# EAGLE design openLRSngTX (EAGLE 6.5.0)
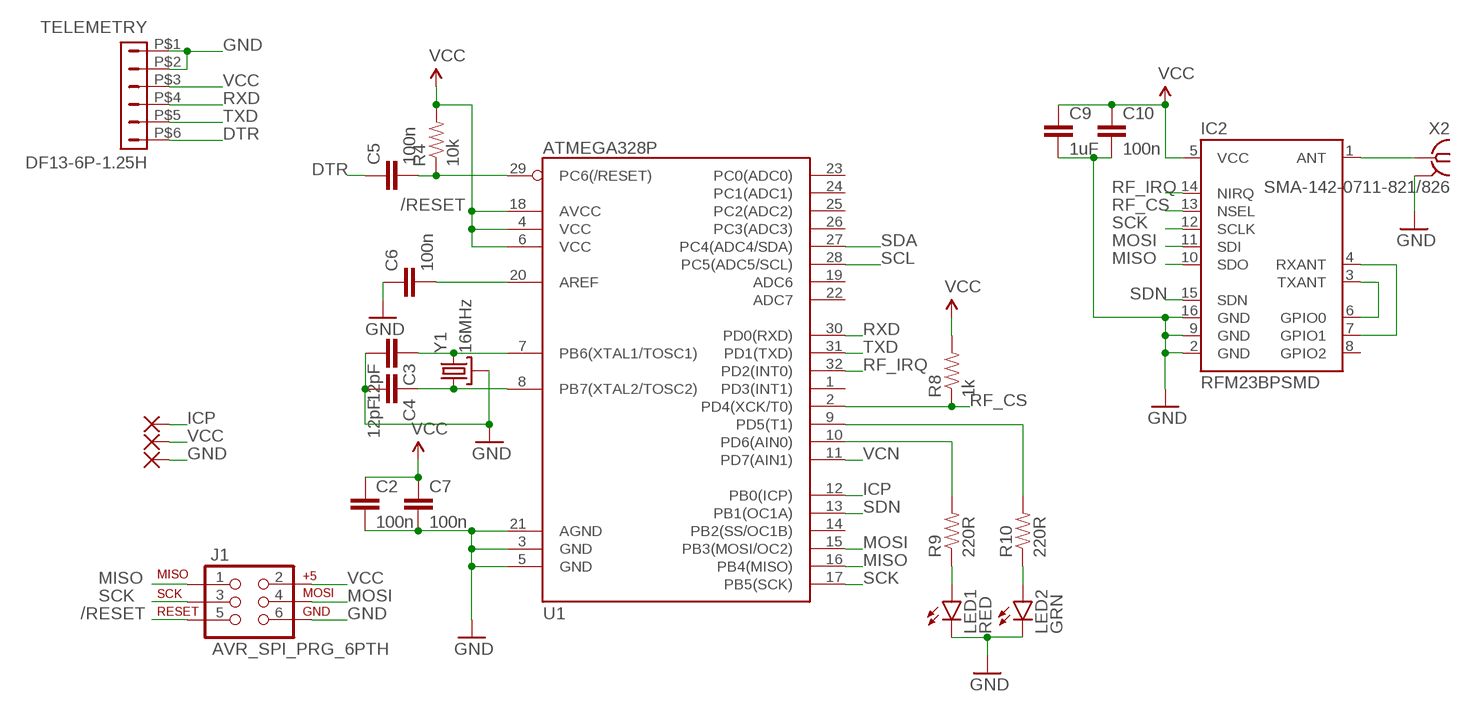
[diagram p0: schematic, sheet 1]

## Parts
C2  100n  CAP0805  [0805]
C3  12pF  CAP0805  [0805]
C4  12pF  CAP0805  [0805]
C5  100n  CAP0805  [0805]
C6  100n  CAP0805  [0805]
C7  100n  CAP0805  [0805]
C9  1uF  CAP0805  [0805]
C10  100n  CAP0805  [0805]
GND  WIREPADSMD1,27-254  [SMD1,27-2,54]
IC2  RFM23BPSMD  [RFM23BP-S2]
ICP  WIREPADSMD1,27-254  [SMD1,27-2,54]
J1  AVR_SPI_PRG_6PTH  [2X3]
LED1  RED  LED1206  [LED-1206]
LED2  GRN  LED1206  [LED-1206]
R4  10k  RESISTOR0805-RES  [0805]
R8  1k  RESISTOR0805-RES  [0805]
R9  220R  RESISTOR0805-RES  [0805]
R10  220R  RESISTOR0805-RES  [0805]
TELEMETRY  DF13-6P-1.25H  [DF13A-6P-1.25H]
U1  ATMEGA328P  ATMEGA328_SMT  [TQFP32-08]
VCC  WIREPADSMD1,27-254  [SMD1,27-2,54]
X2  SMA-142-0711-821/826  [J502-ND-142-0711-821/826]
Y1  16MHz  CRYSTAL3.2X2.5  [CRYSTAL-SMD-5X3]

## Nets
/RESET: C5.2 J1.5 R4.1 U1.29(PC6(/RESET))
DTR: C5.1 TELEMETRY.P$6
GND: C2.2 C3.2 C4.2 C6.1 C7.2 C9.2 C10.2 GND.1(P) IC2.2(GND) IC2.9(GND) IC2.16(GND) J1.6 LED1.C LED2.C TELEMETRY.P$1 TELEMETRY.P$2 U1.3(GND) U1.5(GND) U1.21(AGND) X2.G@1 X2.G@2 X2.G@3 X2.G@4 Y1.2(GND) Y1.4(GND)
ICP: ICP.1(P) U1.12(PB0(ICP))
MISO: IC2.10(SDO) J1.1 U1.16(PB4(MISO))
MOSI: IC2.11(SDI) J1.4 U1.15(PB3(MOSI/OC2))
N$1: IC2.3(TXANT) IC2.6(GPIO0)
N$2: IC2.4(RXANT) IC2.7(GPIO1)
N$7: R9.2 U1.10(PD6(AIN0))
N$8: R10.2 U1.9(PD5(T1))
N$9: LED2.A R10.1
N$10: LED1.A R9.1
N$11: C3.1 U1.7(PB6(XTAL1/TOSC1)) Y1.3
N$12: C4.1 U1.8(PB7(XTAL2/TOSC2)) Y1.1
N$13: IC2.1(ANT) X2.1
N$14: C6.2 U1.20(AREF)
RF_CS: IC2.13(NSEL) R8.1 U1.2(PD4(XCK/T0))
RF_IRQ: IC2.14(NIRQ) U1.32(PD2(INT0))
RXD: TELEMETRY.P$4 U1.30(PD0(RXD))
SCK: IC2.12(SCLK) J1.3 U1.17(PB5(SCK))
SCL: U1.28(PC5(ADC5/SCL))
SDA: U1.27(PC4(ADC4/SDA))
SDN: IC2.15(SDN) U1.13(PB1(OC1A))
TXD: TELEMETRY.P$5 U1.31(PD1(TXD))
VCC: C2.1 C7.1 C9.1 C10.1 IC2.5(VCC) J1.2 R4.2 R8.2 TELEMETRY.P$3 U1.4(VCC) U1.6(VCC) U1.18(AVCC) VCC.1(P)
VCN: U1.11(PD7(AIN1))
Unconnected: IC2.8(GPIO2) U1.1(PD3(INT1)) U1.14(PB2(SS/OC1B)) U1.19(ADC6) U1.22(ADC7) U1.23(PC0(ADC0)) U1.24(PC1(ADC1)) U1.25(PC2(ADC2)) U1.26(PC3(ADC3))

## Library data of the parts
C2-C7 C9 C10 = SparkFun-Capacitors:CAP: Capacitor Standard 0603 ceramic capacitor, and 0.1" leaded capacitor.
GND ICP VCC = wirepad:WIREPAD: Wire PAD connect wire on PCB
IC2 = RFM23:RFM23BP: The RFM23BP is a medium power, low cost radio that is capable of operating in the 434MHz and 900MHz open bands. It's frequency is software defined and there are some very good libraries written for it.
J1 = SparkFun-Connectors:AVR_SPI_PRG_6: AVR ISP 6 Pin This is the reduced ISP connector for AVR programming. Common on Arduino. This footprint will take up less PCB space and can be used with a 10-pin to 6-pin adapter such as SKU: BOB-08508
LED1 LED2 = SparkFun-LED:LED: LEDs Standard schematic elements and footprints for 5mm, 3mm, 1206, and 0603 sized LEDs. 5mm - Spark Fun Electronics SKU : COM-00529 (and others)
R4 R8-R10 = SparkFun-Resistors:RESISTOR: Resistor Basic schematic elements and footprints for 0603, 1206, and PTH resistors.
TELEMETRY = con-hirose-df13:DF13-6P-1.25: DF13-6P 1.25mm Pitch Miniature Crimping Connector.
U1 = SparkFun-DigitalIC:ATMEGA328_SMT: 32-Pin Atmega328 part Commonly used on Arduino compatible boards Available in QFP and QFN packages TQFP is IC-09069 QFN is non-stock; PROD_ID: IC-09069
X2 = con-coax:SMA-: SMA 50 Ohm End Launch Jack Receptacle - Round Contact Johnson Components Source: www.johnsoncomponents.com .. J502-ND.pdf; MF: JOHNSON COMPONENTS; MPN: 142-0711-821; OC_FARNELL: 1019328; OC_NEWARK: 16F3627
Y1 = crystal_3225:CRYSTAL: Various standard crystals. Proven footprints. Spark Fun Electronics SKU : COM-00534

## Net classes
0 default: clearance 0.205 mm

## Board
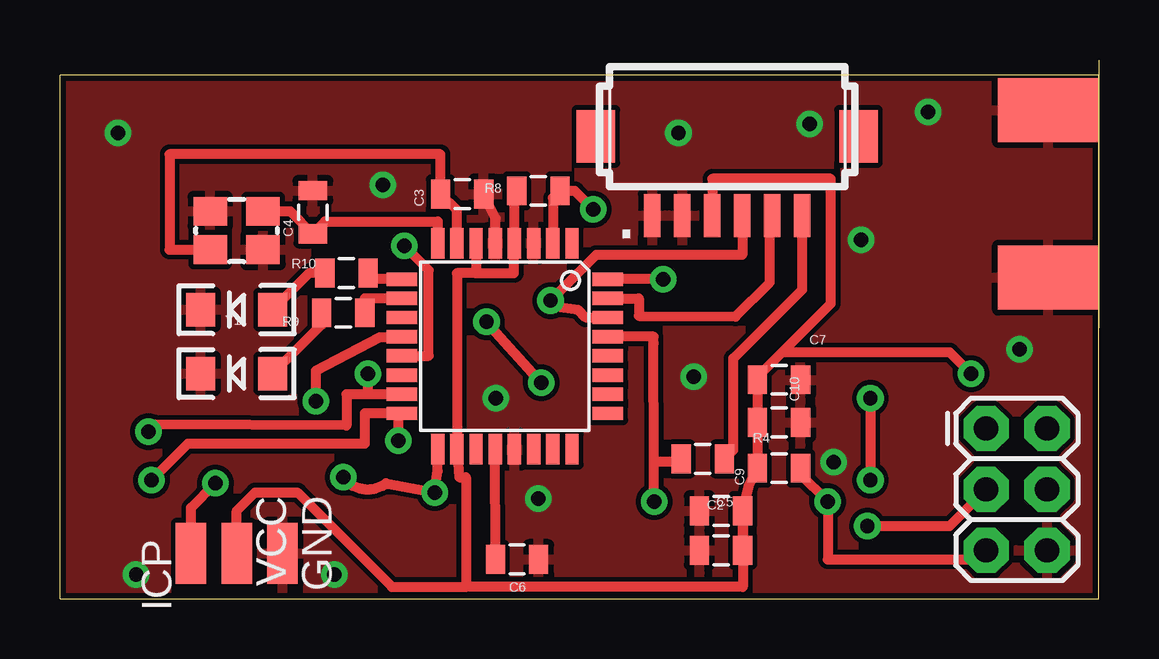
[diagram p1: board, top side]
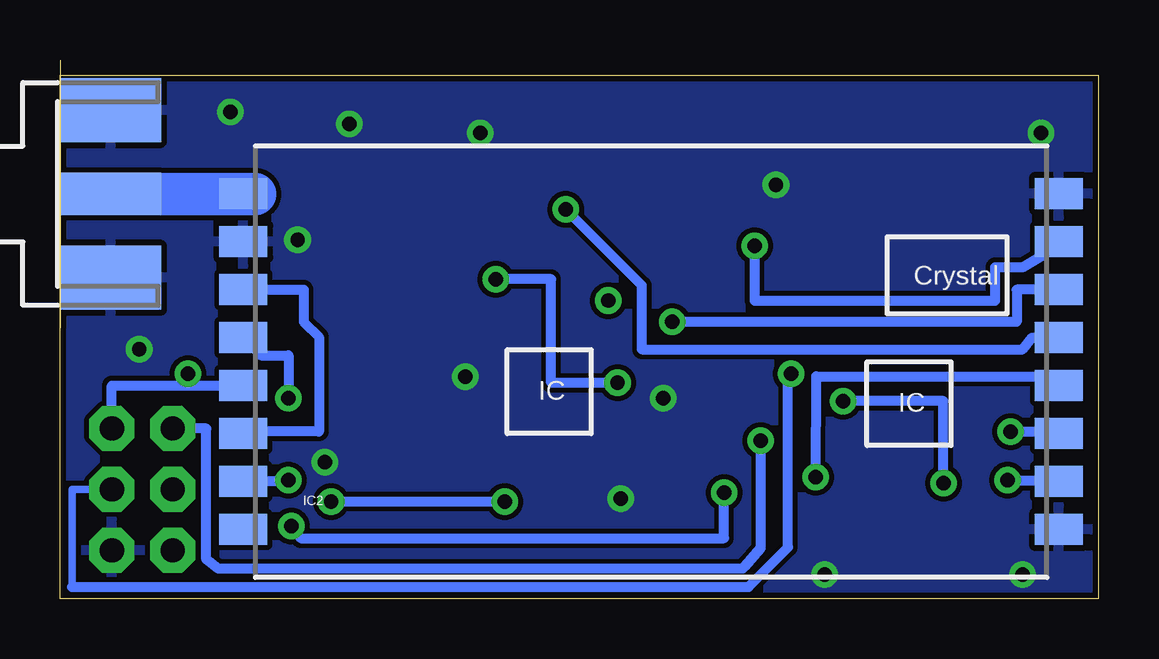
[diagram p2: board, bottom side, seen from below]

Size 43.31 x 21.84 mm. Coordinates in mm from the lower left corner, seen from the top.
Outline: 0,0 0,21.84 43.31,21.84 43.31,0 0,0
Copper layers (1*16): Top 0.035mm / dielectric 1.5mm / Bottom 0.035mm
Design rules "SparkFun": minimum track width 8mil, minimum drill 20mil, track to track 8mil, track to pad 8mil, pad to pad 8mil, via to via 8mil, smd to smd 8mil, copper to edge 10mil, drill to drill 8mil, minimum pad ring 12mil, minimum via ring 10mil, stop-mask expansion 4mil, vias tented up to drill 25mil, thermal gap 10mil

### Footprints (pad centres in the part's own frame; a part is rotated, then mirrored left to right if it is on the bottom)
0805 = smd 0.8 x 1.2: 1 -0.9,0; 2 0.9,0
SMD1,27-2,54 = smd 1.27 x 2.54: 1 0,0
RFM23BP-S2 = smd 2 x 1.3: 1 -17,7; 2 -17,5; 3 -17,3; 4 -17,1; 5 -17,-1; 6 -17,-3; 7 -17,-5; 8 -17,-7; 9 17,-7; 10 17,-5; 11 17,-3; 12 17,-1; 13 17,1; 14 17,3; 15 17,5; 16 17,7
2X3 = drill 1.016 pad 1.88 octagon: 1 0,0; 2 0,2.54; 3 2.54,0; 4 2.54,2.54; 5 5.08,0; 6 5.08,2.54
LED-1206 = smd 1.2 x 1.4: A -1.5,0; C 1.5,0
DF13A-6P-1.25H = smd 1.6 x 2.2: M$0 -5.475,2.4; M$1 5.475,2.4 | smd 0.7 x 1.8: P$1 -3.125,-0.9; P$2 -1.875,-0.9; P$3 -0.625,-0.9; P$4 0.625,-0.9; P$5 1.875,-0.9; P$6 3.125,-0.9
TQFP32-08 = smd 1.27 x 0.559: 1 -4.293,2.8; 2 -4.293,2; 3 -4.293,1.2; 4 -4.293,0.4; 5 -4.293,-0.4; 6 -4.293,-1.2; 7 -4.293,-2; 8 -4.293,-2.8; 17 4.293,-2.8; 18 4.293,-2; 19 4.293,-1.2; 20 4.293,-0.4; 21 4.293,0.4; 22 4.293,1.2; 23 4.293,2; 24 4.293,2.8 | smd 0.559 x 1.27: 9 -2.8,-4.293; 10 -2,-4.293; 11 -1.2,-4.293; 12 -0.4,-4.293; 13 0.4,-4.293; 14 1.2,-4.293; 15 2,-4.293; 16 2.8,-4.293; 25 2.8,4.293; 26 2,4.293; 27 1.2,4.293; 28 0.4,4.293; 29 -0.4,4.293; 30 -1.2,4.293; 31 -2,4.293; 32 -2.8,4.293
J502-ND-142-0711-821/826 = smd 4.191 x 1.778: 1 2.115,0 | smd 4.191 x 2.667: G@1 2.115,3.495; G@2 2.115,-3.495 | smd 4.191 x 2.667 bottom: G@3 2.115,3.495; G@4 2.115,-3.495
CRYSTAL-SMD-5X3 = smd 1.4 x 1.2: 1 -1.1,-0.8; 2 1.1,-0.8; 3 1.1,0.8; 4 -1.1,0.8

### Placement (x,y rotation side)
C2  27.56,2.03 180 top
C3  16.76,16.89 0 top
C4  10.54,16.13 90 top
C5  26.8,5.84 180 top
C6  19.05,1.65 180 top
C7  29.97,9.14 0 top
C9  27.56,3.68 180 top
C10  29.97,7.37 0 top
GND  9.27,1.91 180 top
IC2  18.67,9.91 0 bottom
ICP  5.46,1.91 0 top
J1  38.61,7.11 270 top
LED1  7.37,9.4 180 top
LED2  7.37,12.06 180 top
R4  29.97,5.46 180 top
R8  19.94,17.02 180 top
R9  11.81,11.94 0 top
R10  11.94,13.59 0 top
TELEMETRY  27.81,16.89 0 top
U1  18.54,10.54 270 top
VCC  7.37,1.91 180 top
X2  43.31,16.89 0 bottom
Y1  7.37,15.37 180 top

### Tracks (layer width: path | path; a pad name or v marks a point on that pad's centre or on a via)
/RESET  (via drill 0.6)
  Top 0.406: v32,4.06 32,1.65 38.23,1.65 J1.5 | v24.77,4.06 24.76,5.71 | 24.76,5.71 24.75,10.67 24.75,10.94 U1.29 | v32,4.06 30.87,5.2 R4.1 | 32,4.08 v32,4.06 | C5.2 25.77,5.71 24.76,5.71
  Bottom 0.406: v32,4.06 v24.77,4.06
DTR
  Top 0.406: C5.1 28.07,6.21 28.07,10.03 30.94,12.9 TELEMETRY.P$6
GND  (via drill 0.6)
  Top 0.406: U1.5 18.16,15.88 C3.2
  Bottom 0.203: 1.67,16.89 IC2.16
  other vias: 2.41,19.43 19.94,4.19 32.26,5.71 11.43,1.02 3.17,1.02 26.42,9.27 40.01,10.41 36.2,20.32 18.16,8.38 33.4,14.99 31.24,19.81 25.78,19.43 13.46,17.27
  pour Top: -4.19,-1.02 -4.19,29.59 56.77,29.59 56.77,-0.13
  pour Bottom: -4.19,-1.02 -4.19,29.59 56.77,29.59 56.77,-0.13
ICP  (via drill 0.6)
  Top 0.406: ICP.1 5.46,3.81 v6.48,4.83 | v10.67,8.26 10.67,9.53 13.34,10.92 14.23,10.92 U1.12
  Bottom 0.406: v6.48,4.83 6.48,8.26 v10.67,8.26
MISO  (via drill 0.6)
  Top 0.406: v3.81,4.95 5.33,6.47 12.7,6.47 12.7,7.75 U1.16 14.1,7.74 v14.1,6.6
  Bottom 0.406: v3.81,4.95 1.72,4.95 IC2.10 | J1.1 37.21,7.11 37.21,1.65 36.7,1.27 14.86,1.27 14.76,1.37 14.1,2.13 v14.1,6.6
MOSI  (via drill 0.6)
  Top 0.406: U1.15 12.83,8.54 | 12.83,8.54 11.94,8.54 11.94,7.24 3.97,7.27 v3.68,6.99 | v12.83,9.4 12.83,8.54
  Bottom 0.305: J1.4 42.8,4.57 42.8,0.51
  Bottom 0.406: v3.68,6.99 1.75,6.99 IC2.11 | 42.8,0.51 14.61,0.51 12.95,2.16 12.95,9.27 v12.83,9.4
N$1
  Bottom 0.406: IC2.3 33.15,12.91 33.15,11.56 32.51,10.92 32.51,6.99 35.67,6.99 IC2.6
N$2  (via drill 0.6)
  Top 0.406: v33.78,8.38 v33.78,4.95
  Bottom 0.406: IC2.4 34.92,10.16 33.78,10.16 v33.78,8.38 | v33.78,4.95 34.21,4.91 IC2.7
N$7
  Top 0.406: U1.10 12.71,12.54 R9.2
N$8
  Top 0.406: U1.9 12.84,13.34 R10.2
N$9
  Top 0.406: R10.1 10.39,13.59 LED2.A
N$10
  Top 0.406: R9.1 10.91,11.44 LED1.A
N$11
  Top 0.406: U1.7 16.54,16.21 C3.1 15.86,18.54 4.57,18.54 4.57,14.57 Y1.3
N$12
  Top 0.406: U1.8 15.75,15.75 11.05,15.75 C4.1 9.6,16.17 Y1.1
N$13
  Bottom 1.676: 35.67,16.89 IC2.1
  Bottom 1.778: X2.1 35.67,16.89 35.18,16.89
N$14
  Top 0.406: C6.2 U1.20
RF_CS  (via drill 0.6)
  Top 0.406: U1.2 20.54,16.72 R8.1 21.46,17.02 v22.23,16.26
  Bottom 0.406: IC2.13 2.78,10.91 3.17,10.41 19.05,10.41 19.05,13.08 v22.23,16.26
RF_IRQ  (via drill 0.6)
  Top 0.406: v17.78,11.56 v20.07,9.02 | v25.15,13.34 U1.32
  Bottom 0.406: v20.07,9.02 22.84,9.02 U1.32 v25.15,13.34 | IC2.14 3.43,12.91 3.43,11.56 v17.78,11.56
RXD  (via drill 0.6)
  Top 0.406: U1.30 21.91,11.74 21.59,12.06 20.7,12.19 v20.45,12.45 22.35,14.35 28.44,14.35 TELEMETRY.P$4
SCK  (via drill 0.6)
  Top 0.406: v11.81,5.08 arc90 13.59,4.83 v15.62,4.45 15.75,5.33 arc-90 15.74,5.34 U1.17 | v33.66,3.05 37.08,3.05 J1.3
  Bottom 0.406: 2.43,8.91 IC2.12 2.05,9.29 11.79,9.29 v11.81,5.08 | v33.66,3.05 33.27,2.54 15.62,2.54 v15.62,4.45
SDN  (via drill 0.6)
  Top 0.406: U1.13 15.37,10.14 15.37,13.72 v14.35,14.73
  Bottom 0.406: v14.35,14.73 14.35,12.45 4.32,12.45 4.32,13.84 3.17,13.84 1.67,14.73 IC2.15
TXD
  Top 0.406: U1.31 24.13,12.54 24.13,11.81 28.16,11.78 29.59,13.21 29.59,15.89 TELEMETRY.P$5
VCC  (via drill 0.6)
  Top 0.406: VCC.1 7.37,3.68 8.13,4.45 9.91,4.45 13.84,0.51 16.92,0.51 | C2.1 C9.1 | 16.92,0.51 16.92,5.08 16.64,5.08 U1.18 16.54,13.59 17.34,13.59 | U1.6 17.34,13.59 | 17.34,13.59 18.92,13.59 18.92,14.83 U1.4 18.94,16.92 R8.2 | C9.1 28.46,0.51 16.92,0.51 | C9.1 28.71,4.72 R4.2 C10.1 C7.1 29.07,9.26 30.1,10.29 | v37.97,9.4 37.08,10.29 30.1,10.29 | 30.1,10.29 32.13,12.32 32.13,17.53 27.19,17.53 TELEMETRY.P$3
  Bottom 0.406: J1.2 41.15,8.91 37.72,8.91 | 37.72,8.91 IC2.5 | v37.97,9.4 37.72,9.14 37.72,8.91